# Altium schematic sheet GPIO Expander.SchDoc
size A4; SheetNumber: 8; SheetTotal: 13
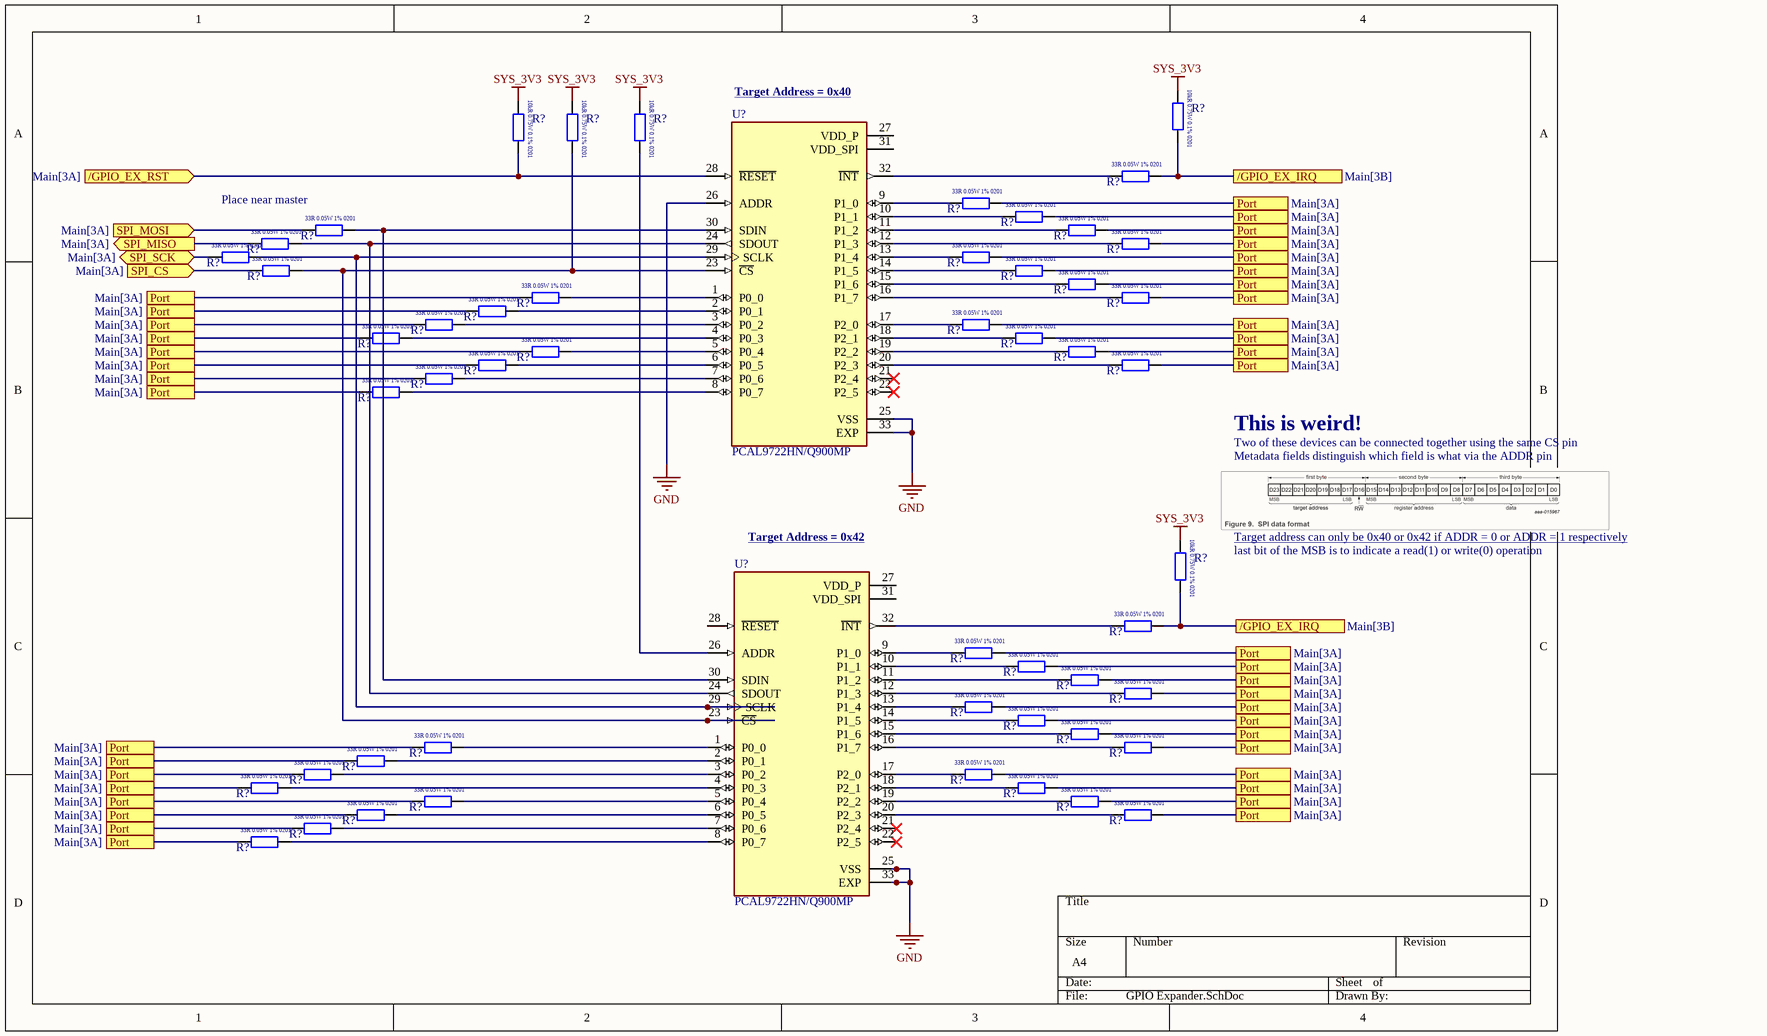
[diagram p0: GPIO Expander.SchDoc]

## Parts
(Parts that share a designator on the sheet are numbered #1, #2 ... from top to bottom, then left to right.)
R?#1  TNPW020110K0BEED  [RESC0603X03N]  (value not drawn)
R?#2  TNPW020110K0BEED  [RESC0603X03N]  (value not drawn)
R?#3  TNPW020110K0BEED  [RESC0603X03N]  (value not drawn)
R?#4  TNPW020110K0BEED  [RESC0603X03N]  (value not drawn)
R?#5  ERJ-1GNF33R0C  [RESC0603X03L]  (value not drawn)
R?#6  ERJ-1GNF33R0C  [RESC0603X03L]  (value not drawn)
R?#7  ERJ-1GNF33R0C  [RESC0603X03L]  (value not drawn)
R?#8  ERJ-1GNF33R0C  [RESC0603X03L]  (value not drawn)
R?#9  ERJ-1GNF33R0C  [RESC0603X03L]  (value not drawn)
R?#10  ERJ-1GNF33R0C  [RESC0603X03L]  (value not drawn)
R?#11  ERJ-1GNF33R0C  [RESC0603X03L]  (value not drawn)
R?#12  ERJ-1GNF33R0C  [RESC0603X03L]  (value not drawn)
R?#13  ERJ-1GNF33R0C  [RESC0603X03L]  (value not drawn)
R?#14  ERJ-1GNF33R0C  [RESC0603X03L]  (value not drawn)
R?#15  ERJ-1GNF33R0C  [RESC0603X03L]  (value not drawn)
R?#16  ERJ-1GNF33R0C  [RESC0603X03L]  (value not drawn)
R?#17  ERJ-1GNF33R0C  [RESC0603X03L]  (value not drawn)
R?#18  ERJ-1GNF33R0C  [RESC0603X03L]  (value not drawn)
R?#19  ERJ-1GNF33R0C  [RESC0603X03L]  (value not drawn)
R?#20  ERJ-1GNF33R0C  [RESC0603X03L]  (value not drawn)
R?#21  ERJ-1GNF33R0C  [RESC0603X03L]  (value not drawn)
R?#22  ERJ-1GNF33R0C  [RESC0603X03L]  (value not drawn)
R?#23  ERJ-1GNF33R0C  [RESC0603X03L]  (value not drawn)
R?#24  ERJ-1GNF33R0C  [RESC0603X03L]  (value not drawn)
R?#25  ERJ-1GNF33R0C  [RESC0603X03L]  (value not drawn)
R?#26  ERJ-1GNF33R0C  [RESC0603X03L]  (value not drawn)
R?#27  ERJ-1GNF33R0C  [RESC0603X03L]  (value not drawn)
R?#28  ERJ-1GNF33R0C  [RESC0603X03L]  (value not drawn)
R?#29  ERJ-1GNF33R0C  [RESC0603X03L]  (value not drawn)
R?#30  TNPW020110K0BEED  [RESC0603X03N]  (value not drawn)
R?#31  ERJ-1GNF33R0C  [RESC0603X03L]  (value not drawn)
R?#32  ERJ-1GNF33R0C  [RESC0603X03L]  (value not drawn)
R?#33  ERJ-1GNF33R0C  [RESC0603X03L]  (value not drawn)
R?#34  ERJ-1GNF33R0C  [RESC0603X03L]  (value not drawn)
R?#35  ERJ-1GNF33R0C  [RESC0603X03L]  (value not drawn)
R?#36  ERJ-1GNF33R0C  [RESC0603X03L]  (value not drawn)
R?#37  ERJ-1GNF33R0C  [RESC0603X03L]  (value not drawn)
R?#38  ERJ-1GNF33R0C  [RESC0603X03L]  (value not drawn)
R?#39  ERJ-1GNF33R0C  [RESC0603X03L]  (value not drawn)
R?#40  ERJ-1GNF33R0C  [RESC0603X03L]  (value not drawn)
R?#41  ERJ-1GNF33R0C  [RESC0603X03L]  (value not drawn)
R?#42  ERJ-1GNF33R0C  [RESC0603X03L]  (value not drawn)
R?#43  ERJ-1GNF33R0C  [RESC0603X03L]  (value not drawn)
R?#44  ERJ-1GNF33R0C  [RESC0603X03L]  (value not drawn)
R?#45  ERJ-1GNF33R0C  [RESC0603X03L]  (value not drawn)
R?#46  ERJ-1GNF33R0C  [RESC0603X03L]  (value not drawn)
R?#47  ERJ-1GNF33R0C  [RESC0603X03L]  (value not drawn)
R?#48  ERJ-1GNF33R0C  [RESC0603X03L]  (value not drawn)
R?#49  ERJ-1GNF33R0C  [RESC0603X03L]  (value not drawn)
R?#50  ERJ-1GNF33R0C  [RESC0603X03L]  (value not drawn)
R?#51  ERJ-1GNF33R0C  [RESC0603X03L]  (value not drawn)
U?#1  PCAL9722HN/Q900MP  [IC_PCAL9722HN/Q900MP]
U?#2  PCAL9722HN/Q900MP  [IC_PCAL9722HN/Q900MP]

## Ports
/GPIO_EX_IRQ (see Main[3B]), /GPIO_EX_RST (in, see Main[3A]), Port (see Main[3A]), SPI_CS (in, see Main[3A]), SPI_MISO (out, see Main[3A]), SPI_MOSI (in, see Main[3A]), SPI_SCK (bidir, see Main[3A])

## Nets
GND: U?#1.25(VSS) U?#1.26(ADDR) U?#1.33(EXP) U?#2.25(VSS) U?#2.33(EXP)
SYS_3V3: R?#1.1 R?#2.1 R?#3.1 R?#4.1 R?#30.1
/GPIO_EX_IRQ: R?#1.2 R?#5.2 R?#30.2 R?#31.2 ; port /GPIO_EX_IRQ
/GPIO_EX_RST: R?#2.2 U?#1.28(~{RESET}) ; port /GPIO_EX_RST
Port: R?#6.2 R?#7.2 R?#9.2 R?#11.2 R?#13.2 R?#15.2 R?#16.2 R?#17.1 R?#18.2 R?#19.1 R?#20.1 R?#21.2 R?#22.1 R?#23.2 R?#24.1 R?#25.2 R?#26.1 R?#27.2 R?#28.1 R?#29.1 R?#32.2 R?#33.2 R?#34.2 R?#35.2 R?#36.2 R?#37.2 R?#38.2 R?#39.1 R?#40.2 R?#41.1 R?#42.1 R?#43.2 R?#44.1 R?#45.2 R?#46.1 R?#47.2 R?#48.1 R?#49.2 R?#50.1 R?#51.1 ; port Port
SPI_CS: R?#14.1 ; port SPI_CS
SPI_MISO: R?#10.1 ; port SPI_MISO
SPI_MOSI: R?#8.1 ; port SPI_MOSI
SPI_SCK: R?#12.1 ; port SPI_SCK
NetR?#3_2: R?#3.2 R?#14.2 U?#1.23(~{CS}) U?#2.23(~{CS})
NetR?#4_2: R?#4.2 U?#2.26(ADDR)
NetR?#5_1: R?#5.1 U?#1.32(~{INT})
NetR?#6_1: R?#6.1 U?#1.9(P1_0)
NetR?#7_1: R?#7.1 U?#1.10(P1_1)
NetR?#8_2: R?#8.2 U?#1.30(SDIN) U?#2.30(SDIN)
NetR?#9_1: R?#9.1 U?#1.11(P1_2)
NetR?#10_2: R?#10.2 U?#1.24(SDOUT) U?#2.24(SDOUT)
NetR?#11_1: R?#11.1 U?#1.12(P1_3)
NetR?#12_2: R?#12.2 U?#1.29(SCLK) U?#2.29(SCLK)
NetR?#13_1: R?#13.1 U?#1.13(P1_4)
NetR?#15_1: R?#15.1 U?#1.14(P1_5)
NetR?#16_1: R?#16.1 U?#1.15(P1_6)
NetR?#17_2: R?#17.2 U?#1.1(P0_0)
NetR?#18_1: R?#18.1 U?#1.16(P1_7)
NetR?#19_2: R?#19.2 U?#1.2(P0_1)
NetR?#20_2: R?#20.2 U?#1.3(P0_2)
NetR?#21_1: R?#21.1 U?#1.17(P2_0)
NetR?#22_2: R?#22.2 U?#1.4(P0_3)
NetR?#23_1: R?#23.1 U?#1.18(P2_1)
NetR?#24_2: R?#24.2 U?#1.5(P0_4)
NetR?#25_1: R?#25.1 U?#1.19(P2_2)
NetR?#26_2: R?#26.2 U?#1.6(P0_5)
NetR?#27_1: R?#27.1 U?#1.20(P2_3)
NetR?#28_2: R?#28.2 U?#1.7(P0_6)
NetR?#29_2: R?#29.2 U?#1.8(P0_7)
NetR?#31_1: R?#31.1 U?#2.32(~{INT})
NetR?#32_1: R?#32.1 U?#2.9(P1_0)
NetR?#33_1: R?#33.1 U?#2.10(P1_1)
NetR?#34_1: R?#34.1 U?#2.11(P1_2)
NetR?#35_1: R?#35.1 U?#2.12(P1_3)
NetR?#36_1: R?#36.1 U?#2.13(P1_4)
NetR?#37_1: R?#37.1 U?#2.14(P1_5)
NetR?#38_1: R?#38.1 U?#2.15(P1_6)
NetR?#39_2: R?#39.2 U?#2.1(P0_0)
NetR?#40_1: R?#40.1 U?#2.16(P1_7)
NetR?#41_2: R?#41.2 U?#2.2(P0_1)
NetR?#42_2: R?#42.2 U?#2.3(P0_2)
NetR?#43_1: R?#43.1 U?#2.17(P2_0)
NetR?#44_2: R?#44.2 U?#2.4(P0_3)
NetR?#45_1: R?#45.1 U?#2.18(P2_1)
NetR?#46_2: R?#46.2 U?#2.5(P0_4)
NetR?#47_1: R?#47.1 U?#2.19(P2_2)
NetR?#48_2: R?#48.2 U?#2.6(P0_5)
NetR?#49_1: R?#49.1 U?#2.20(P2_3)
NetR?#50_2: R?#50.2 U?#2.7(P0_6)
NetR?#51_2: R?#51.2 U?#2.8(P0_7)

Not connected (* = marked no-connect by the designer): U?#1 21(P2_4)* 22(P2_5)* 27(VDD_P) 31(VDD_SPI); U?#2 21(P2_4)* 22(P2_5)* 27(VDD_P) 28(~{RESET}) 31(VDD_SPI)

## Notes on the sheet
- (near U?#1) Target Address = 0x40
- (near R?#8) Place near master
- This is weird!
- Two of these devices can be connected together using the same CS pin
- Metadata fields distinguish which field is what via the ADDR pin
- (near U?#2) Target Address = 0x42
- Target address can only be 0x40 or 0x42 if ADDR = 0 or ADDR = 1 respectively
- (near R?#30) last bit of the MSB is to indicate a read(1) or write(0) operation
- (in symbol ERJ-1GNF33R0C) 33R 0.05W 1% 0201
- (in symbol TNPW020110K0BEED) 10kR 0.75W 0.1% 0201

## Library data of the parts
R?#1-R?#4 R?#30 = TNPW020110K0BEED: 10 kOhms ±0.1% 0.075W Chip Resistor 0201 (0603 Metric) Anti-Sulfur, Automotive AEC-Q200, Moisture Resistant Thin Film
R?#5-R?#29 R?#31-R?#51 = ERJ-1GNF33R0C: 33 Ohms ±1% 0.05W, 1/20W Chip Resistor 0201 (0603 Metric) Thick Film; ComponentLink1Description: New link; ComponentLink1URL: https://www.digikey.com.au/en/products/detail/panasonic-electronic-components/ERJ-1GNF33R0C/2035941
U?#1 U?#2 = PCAL9722HN/Q900MP: MF: {'manufacturer': u'NXP Semiconductors'}; Package: None; Price: None; Value: *; MP: PCAL9722HN/Q900MP; Availability: Unavailable